# EAGLE schematic ccnor_stm32_v24-sync (EAGLE 6.1)
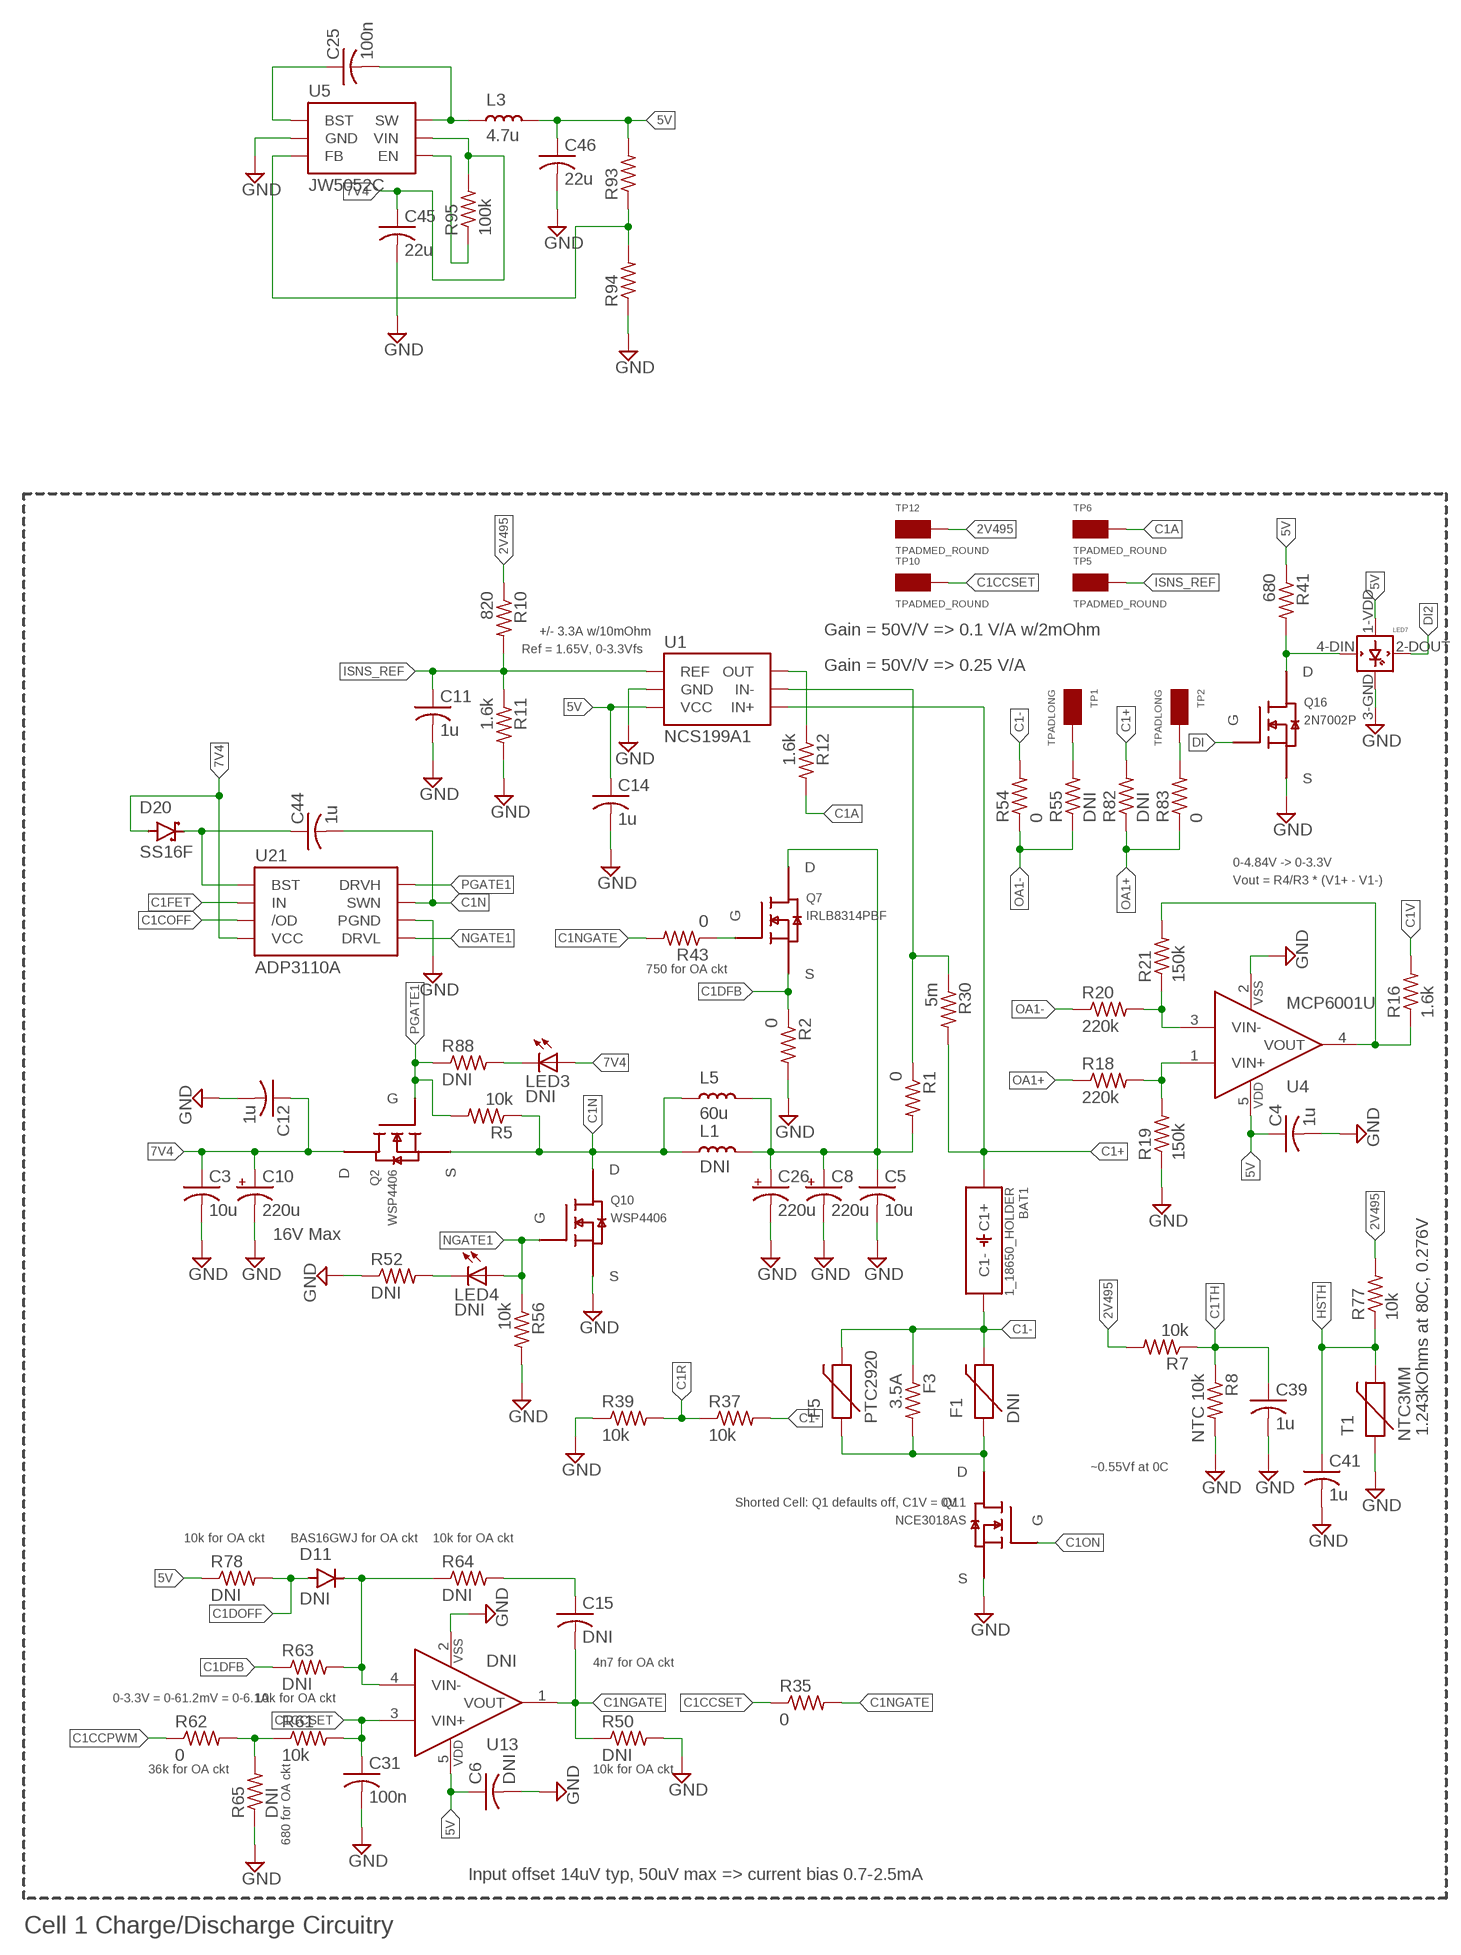
[diagram p0: schematic, sheet 1, part 1 of 2]
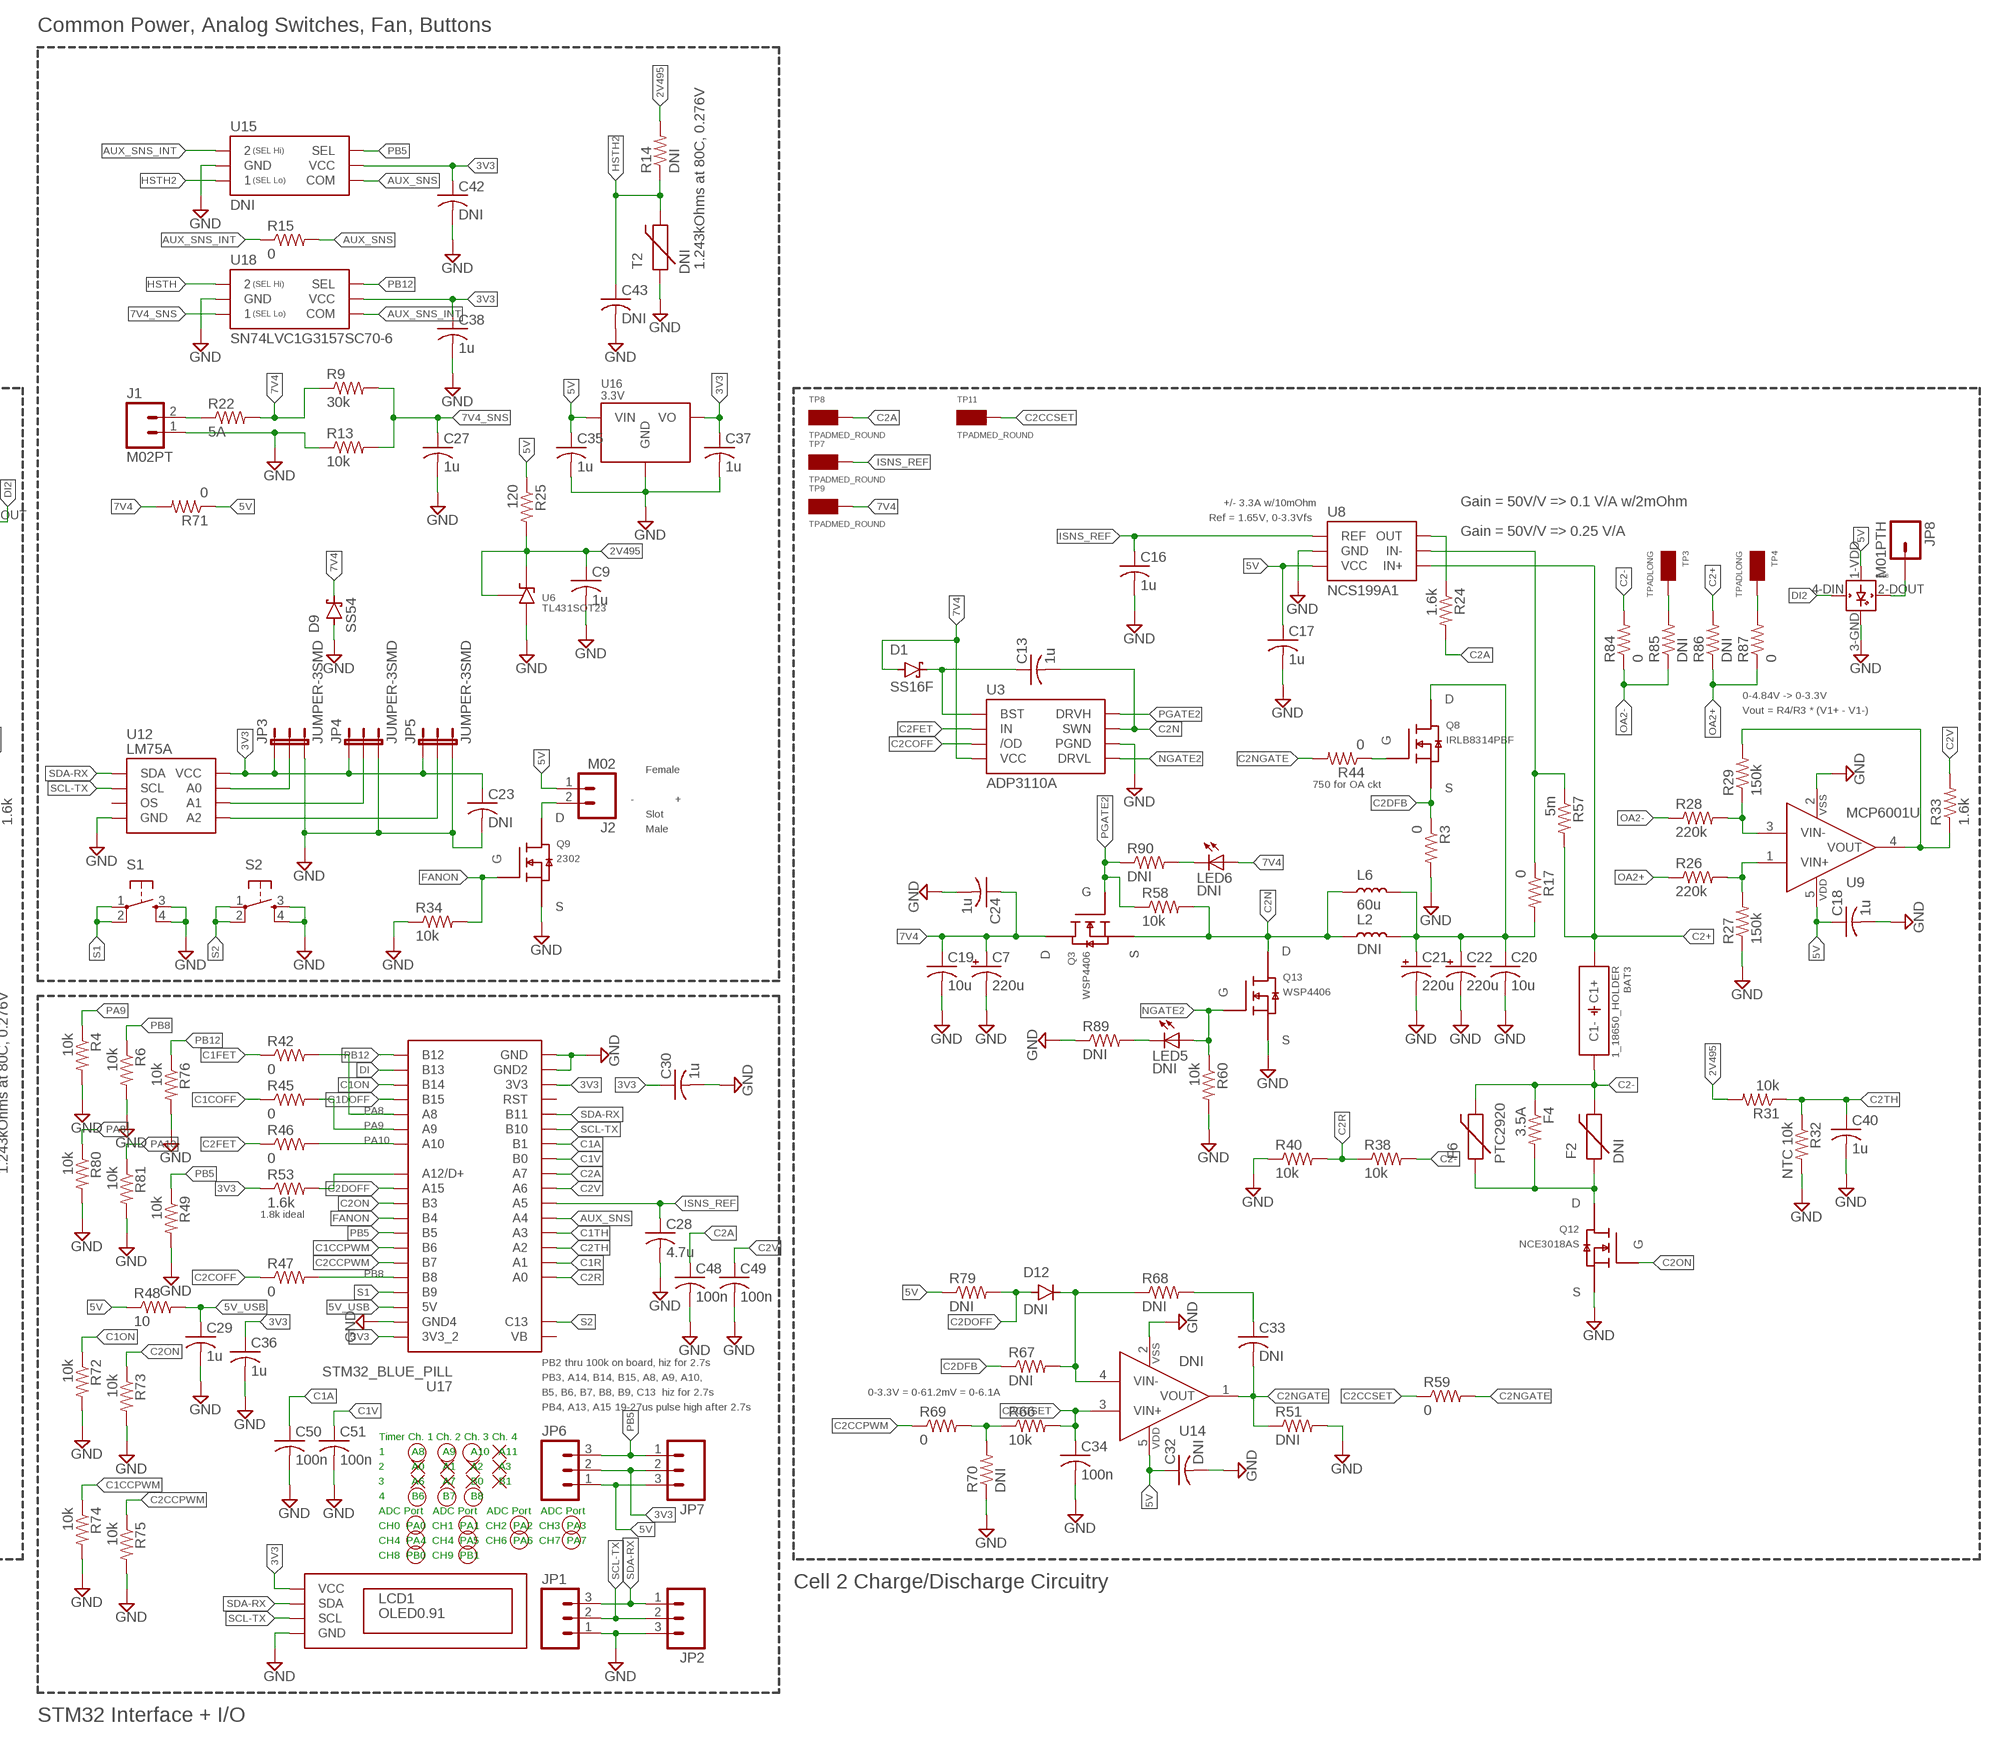
[diagram p1: schematic, sheet 1, part 2 of 2]

## Parts
BAT1  1_18650_HOLDER  [1S_18650_SMD_NH]
BAT3  1_18650_HOLDER  [1S_18650_SMD_NH]
C3  10u  C-USC1206  [C1206]
C4  1u  C-USC0402  [C0402]
C5  10u  C-USC1206  [C1206]
C6  DNI  C-USC0402  [C0402]
C7  220u  CPOL-USD  [PANASONIC_D]
C8  220u  CPOL-USD  [PANASONIC_D]
C9  1u  C-USC0402  [C0402]
C10  220u  CPOL-USD  [PANASONIC_D]
C11  1u  C-USC0402  [C0402]
C12  1u  C-USC0402  [C0402]
C13  1u  C-USC0603  [C0603]
C14  1u  C-USC0402  [C0402]
C15  DNI  C-USC0402  [C0402]
C16  1u  C-USC0402  [C0402]
C17  1u  C-USC0402  [C0402]
C18  1u  C-USC0402  [C0402]
C19  10u  C-USC1206  [C1206]
C20  10u  C-USC1206  [C1206]
C21  220u  CPOL-USD  [PANASONIC_D]
C22  220u  CPOL-USD  [PANASONIC_D]
C23  DNI  C-USC0402  [C0402]
C24  1u  C-USC0402  [C0402]
C25  100n  C-USC0402  [C0402]
C26  220u  CPOL-USD  [PANASONIC_D]
C27  1u  C-USC0402  [C0402]
C28  4.7u  C-USC0402  [C0402]
C29  1u  C-USC0402  [C0402]
C30  1u  C-USC0402  [C0402]
C31  100n  C-USC0402  [C0402]
C32  DNI  C-USC0402  [C0402]
C33  DNI  C-USC0402  [C0402]
C34  100n  C-USC0402  [C0402]
C35  1u  C-USC0402  [C0402]
C36  1u  C-USC0402  [C0402]
C37  1u  C-USC0402  [C0402]
C38  1u  C-USC0402  [C0402]
C39  1u  C-USC0402  [C0402]
C40  1u  C-USC0402  [C0402]
C41  1u  C-USC0402  [C0402]
C42  DNI  C-USC0402  [C0402]
C43  DNI  C-USC0402  [C0402]
C44  1u  C-USC0603  [C0603]
C45  22u  C-USC0805  [C0805]
C46  22u  C-USC0603  [C0603]
C48  100n  C-USC0402  [C0402]
C49  100n  C-USC0402  [C0402]
C50  100n  C-USC0402  [C0402]
C51  100n  C-USC0402  [C0402]
D1  SS16F  DIODE_SCHOTTKYCDBM140-G  [SOD123]
D9  SS54  [SMA]
D11  DNI  BAT60A  [SOD323]
D12  DNI  BAT60A  [SOD323]
D20  SS16F  DIODE_SCHOTTKYCDBM140-G  [SOD123]
F1  DNI  PTC1812  [1812]
F2  DNI  PTC1812  [1812]
F3  3.5A  R-US_R1206  [R1206]
F4  3.5A  R-US_R1206  [R1206]
F5  PTC2920  [2920]
F6  PTC2920  [2920]
J1  M02PT  [PHOENIXCONTACT1935161]
J2  M02  [B2B-XH-A]
JP1  M03PTH  [1X03]
JP2  M03PTH  [1X03]
JP3  JUMPER-3SMD  [SJ_3]
JP4  JUMPER-3SMD  [SJ_3]
JP5  JUMPER-3SMD  [SJ_3]
JP6  M03PTH  [1X03]
JP7  M03PTH  [1X03]
JP8  M01PTH  [1X01]
L1  DNI  SDR1307  [INDUCTOR_SMD_13MM]
L2  DNI  SDR1307  [INDUCTOR_SMD_13MM]
L3  4.7u  INDUCTOR0805  [0805]
L5  60u  INDUCTOR10A  [INDUCTOR_10A_8.2MMX21MM]
L6  60u  INDUCTOR10A  [INDUCTOR_10A_8.2MMX21MM]
LCD1  OLED0.91  [OLED0.91]
LED3  DNI  LEDCHIPLED_0603  [CHIPLED_0603]
LED4  DNI  LEDCHIPLED_0603  [CHIPLED_0603]
LED5  DNI  LEDCHIPLED_0603  [CHIPLED_0603]
LED6  DNI  LEDCHIPLED_0603  [CHIPLED_0603]
LED7  WS2812B  [WS2812B]
LED8  WS2812B  [WS2812B]
Q2  WSP4406  N-MOSFET-SOIC8  [8-SOIC]
Q3  WSP4406  N-MOSFET-SOIC8  [8-SOIC]
Q7  IRLB8314PBF  [TO-220]
Q8  IRLB8314PBF  [TO-220]
Q9  2302  2N7002P  [SOT23]
Q10  WSP4406  N-MOSFET-SOIC8  [8-SOIC]
Q11  NCE3018AS  N-MOSFET-SOIC8  [8-SOIC]
Q12  NCE3018AS  N-MOSFET-SOIC8  [8-SOIC]
Q13  WSP4406  N-MOSFET-SOIC8  [8-SOIC]
Q16  2N7002P  [SOT23]
R1  0  R-US_R1206  [R1206]
R2  0  R-US_R1206  [R1206]
R3  0  R-US_R1206  [R1206]
R4  10k  R-US_R0402  [R0402]
R5  10k  R-US_R0402  [R0402]
R6  10k  R-US_R0402  [R0402]
R7  10k  R-US_R0402  [R0402]
R8  NTC 10k  R-US_R0402  [R0402]
R9  30k  R-US_R0402  [R0402]
R10  820  R-US_R0402  [R0402]
R11  1.6k  R-US_R0402  [R0402]
R12  1.6k  R-US_R0402  [R0402]
R13  10k  R-US_R0402  [R0402]
R14  DNI  R-US_R0402  [R0402]
R15  0  R-US_R0402  [R0402]
R16  1.6k  R-US_R0402  [R0402]
R17  0  R-US_R1206  [R1206]
R18  220k  R-US_R0402  [R0402]
R19  150k  R-US_R0402  [R0402]
R20  220k  R-US_R0402  [R0402]
R21  150k  R-US_R0402  [R0402]
R22  5A  R-US_R1206  [R1206]
R24  1.6k  R-US_R0402  [R0402]
R25  120  R-US_R0402  [R0402]
R26  220k  R-US_R0402  [R0402]
R27  150k  R-US_R0402  [R0402]
R28  220k  R-US_R0402  [R0402]
R29  150k  R-US_R0402  [R0402]
R30  5m  R-US_R1206  [R1206]
R31  10k  R-US_R0402  [R0402]
R32  NTC 10k  R-US_R0402  [R0402]
R33  1.6k  R-US_R0402  [R0402]
R34  10k  R-US_R0402  [R0402]
R35  0  R-US_R0402  [R0402]
R37  10k  R-US_R0402  [R0402]
R38  10k  R-US_R0402  [R0402]
R39  10k  R-US_R0402  [R0402]
R40  10k  R-US_R0402  [R0402]
R41  680  R-US_R0402  [R0402]
R42  0  R-US_R0402  [R0402]
R43  0  R-US_R0402  [R0402]
R44  0  R-US_R0402  [R0402]
R45  0  R-US_R0402  [R0402]
R46  0  R-US_R0402  [R0402]
R47  0  R-US_R0402  [R0402]
R48  10  R-US_R0402  [R0402]
R49  10k  R-US_R0402  [R0402]
R50  DNI  R-US_R0402  [R0402]
R51  DNI  R-US_R0402  [R0402]
R52  DNI  R-US_R0402  [R0402]
R53  1.6k  R-US_R0402  [R0402]
R54  0  R-US_R0402  [R0402]
R55  DNI  R-US_R0402  [R0402]
R56  10k  R-US_R0402  [R0402]
R57  5m  R-US_R1206  [R1206]
R58  10k  R-US_R0402  [R0402]
R59  0  R-US_R0402  [R0402]
R60  10k  R-US_R0402  [R0402]
R61  10k  R-US_R0402  [R0402]
R62  0  R-US_R0402  [R0402]
R63  DNI  R-US_R0402  [R0402]
R64  DNI  R-US_R0402  [R0402]
R65  DNI  R-US_R0402  [R0402]
R66  10k  R-US_R0402  [R0402]
R67  DNI  R-US_R0402  [R0402]
R68  DNI  R-US_R0402  [R0402]
R69  0  R-US_R0402  [R0402]
R70  DNI  R-US_R0402  [R0402]
R71  0  R-US_R0603  [R0603]
R72  10k  R-US_R0402  [R0402]
R73  10k  R-US_R0402  [R0402]
R74  10k  R-US_R0402  [R0402]
R75  10k  R-US_R0402  [R0402]
R76  10k  R-US_R0402  [R0402]
R77  10k  R-US_R0402  [R0402]
R78  DNI  R-US_R0402  [R0402]
R79  DNI  R-US_R0402  [R0402]
R80  10k  R-US_R0402  [R0402]
R81  10k  R-US_R0402  [R0402]
R82  DNI  R-US_R0402  [R0402]
R83  0  R-US_R0402  [R0402]
R84  0  R-US_R0402  [R0402]
R85  DNI  R-US_R0402  [R0402]
R86  DNI  R-US_R0402  [R0402]
R87  0  R-US_R0402  [R0402]
R88  DNI  R-US_R0402  [R0402]
R89  DNI  R-US_R0402  [R0402]
R90  DNI  R-US_R0402  [R0402]
R93  R-US_R0402  [R0402]
R94  R-US_R0402  [R0402]
R95  100k  R-US_R0402  [R0402]
S1  TAC_SWITCHSMD  [TACTILE_SWITCH_SMD]
S2  TAC_SWITCHSMD  [TACTILE_SWITCH_SMD]
T1  NTC3MM  PTCNTC3MM  [THERMISTOR_3MMX3MM]
T2  DNI  PTCNTC3MM  [THERMISTOR_3MMX3MM]
TP1  TPADLONG  [TPAD_LONG]
TP2  TPADLONG  [TPAD_LONG]
TP3  TPADLONG  [TPAD_LONG]
TP4  TPADLONG  [TPAD_LONG]
TP5  TPADMED_ROUND  [TPAD_MED_ROUND]
TP6  TPADMED_ROUND  [TPAD_MED_ROUND]
TP7  TPADMED_ROUND  [TPAD_MED_ROUND]
TP8  TPADMED_ROUND  [TPAD_MED_ROUND]
TP9  TPADMED_ROUND  [TPAD_MED_ROUND]
TP10  TPADMED_ROUND  [TPAD_MED_ROUND]
TP11  TPADMED_ROUND  [TPAD_MED_ROUND]
TP12  TPADMED_ROUND  [TPAD_MED_ROUND]
U1  NCS199A1  INA214  [SOT-363]
U3  ADP3110A  [8-SOIC]
U4  MCP6001U  [SOT23-5]
U5  JW5052C  [SOT23-6]
U6  TL431SOT23  [SOT23]
U8  NCS199A1  INA214  [SOT-363]
U9  MCP6001U  [SOT23-5]
U12  LM75A  [8-SOIC]
U13  DNI  NCS325  [SOT23-5]
U14  DNI  NCS325  [SOT23-5]
U15  DNI  SN74LVC1G3157SC70-6  [SC70-6]
U16  3.3V  AP1117UR133-B  [SOT-89]
U17  STM32_BLUE_PILL  [STM32_BLUE_PILL_USABLE]
U18  SN74LVC1G3157SC70-6  [SC70-6]
U21  ADP3110A  [8-SOIC]

## Nets
2V495: C9.1 R7.2 R10.1 R14.2 R25.2 R31.2 R77.2 TP12.1 U6.1(K) U6.2(REF)
3V3: C23.1 C30.1 C36.1 C37.1 C38.1 C42.1 JP3.1 JP4.1 JP5.1 JP6.2 JP7.2 LCD1.2-VCC(VCC) R53.1 U12.8(VCC) U15.5(VCC) U16.1(VO) U17.3V3 U17.3V3_2 U18.5(VCC)
5V: C4.1 C6.1 C14.1 C17.1 C18.1 C32.1 C35.1 C46.1 J2.1 JP6.1 JP7.3 L3.2 LED7.1-VDD(VDD) LED8.1-VDD(VDD) R25.1 R41.1 R48.1 R71.1 R78.1 R79.1 R93.2 U1.3(VCC) U4.5(VDD) U8.3(VCC) U9.5(VDD) U13.5(VDD) U14.5(VDD) U16.3(VIN)
5V_USB: C29.1 R48.2 U17.5V
7V4: C3.1 C7.+ C10.+ C12.1 C19.1 C24.1 C45.1 D1.A(ANODE) D9.K(CATHODE) D20.A(ANODE) LED3.A LED6.A Q2.5(D) Q2.6(D) Q2.7(D) Q2.8(D) Q3.5(D) Q3.6(D) Q3.7(D) Q3.8(D) R9.1 R22.2 R71.2 R95.2 TP9.1 U3.4(VCC) U5.5(VIN) U21.4(VCC)
7V4_SNS: C27.1 R9.2 R13.2 U18.3
AUX_SNS: R15.2 U15.4(COM) U17.A4
AUX_SNS_INT: R15.1 U15.1 U18.4(COM)
BST: C44.1 D20.K(CATHODE) U21.1(BST)
BST2: C13.1 D1.K(CATHODE) U3.1(BST)
C1+: BAT1.1+(C1+) R30.2 R82.2 U1.4(IN+)
C1-: BAT1.1-(C1-) F1.2 F3.1 F5.K R37.2 R54.2
C1A: C50.1 R12.2 TP6.1 U17.B1
C1CCPWM: R62.1 R74.1 U17.B6
C1CCSET: C31.1 R35.1 R61.2 TP10.1 U13.3(VIN+)
C1COFF: R45.1 U21.3(/OD)
C1DFB: Q7.3(S) R2.1 R63.1
C1DOFF: D11.A(ANODE) R78.2 U17.B15
C1FET: R42.1 U21.2(IN)
C1N: C44.2 L1.1 L5.P$1 Q2.1(S) Q2.2(S) Q2.3(S) Q10.5(D) Q10.6(D) Q10.7(D) Q10.8(D) R5.1 U21.7(SWN)
C1NGATE: C15.2 R35.2 R43.2 R50.1 U13.1(VOUT)
C1ON: Q11.4(G) R72.1 U17.B14
C1R: R37.1 R39.2 U17.A1
C1TH: C39.1 R7.1 R8.1 U17.A3
C1V: C51.1 R16.2 U17.B0
C1V_OA: R16.1 R21.2 U4.4(VOUT)
C1VFBN: C15.1 R64.2
C1VFBN2: C33.1 R68.2
C2+: BAT3.1+(C1+) R57.2 R86.2 U8.4(IN+)
C2-: BAT3.1-(C1-) F2.2 F4.1 F6.K R38.2 R84.2
C2A: C48.1 R24.2 TP8.1 U17.A7
C2CCPWM: R69.1 R75.1 U17.B7
C2CCSET: C34.1 R59.1 R66.2 TP11.1 U14.3(VIN+)
C2COFF: R47.1 U3.3(/OD)
C2DFB: Q8.3(S) R3.1 R67.1
C2DOFF: D12.A(ANODE) R79.2 U17.A15
C2FET: R46.1 U3.2(IN)
C2N: C13.2 L2.1 L6.P$1 Q3.1(S) Q3.2(S) Q3.3(S) Q13.5(D) Q13.6(D) Q13.7(D) Q13.8(D) R58.2 U3.7(SWN)
C2NGATE: C33.2 R44.2 R51.1 R59.2 U14.1(VOUT)
C2ON: Q12.4(G) R73.1 U17.B3
C2R: R38.1 R40.2 U17.A0
C2TH: C40.1 R31.1 R32.1 U17.A2
C2V: C49.1 R33.2 U17.A6
C2V_OA: R29.2 R33.1 U9.4(VOUT)
DI: Q16.1(G) U17.B13
DI1: LED7.4-DIN(DIN) Q16.3(D) R41.2
DI2: LED7.2-DOUT(DOUT) LED8.4-DIN(DIN)
FANON: Q9.1(G) R34.2 U17.B4
GND: C3.2 C4.2 C5.2 C6.2 C7.- C8.- C9.2 C10.- C11.2 C12.2 C14.2 C16.2 C17.2 C18.2 C19.2 C20.2 C21.- C22.- C23.2 C24.2 C26.- C27.2 C28.2 C29.2 C30.2 C31.2 C32.2 C34.2 C35.2 C36.2 C37.2 C38.2 C39.2 C40.2 C41.2 C42.2 C43.2 C45.2 C46.2 C48.2 C49.2 C50.2 C51.2 D9.A(ANODE) J1.1 JP1.1 JP2.3 JP3.3 JP4.3 JP5.3 LCD1.1=GND(GND) LED7.3-GND(GND) LED8.3-GND(GND) Q9.2(S) Q10.1(S) Q10.2(S) Q10.3(S) Q11.1(S) Q11.2(S) Q11.3(S) Q12.1(S) Q12.2(S) Q12.3(S) Q13.1(S) Q13.2(S) Q13.3(S) Q16.2(S) R2.2 R3.2 R4.2 R6.2 R8.2 R11.2 R13.1 R19.1 R27.1 R32.2 R34.1 R39.1 R40.1 R49.2 R50.2 R51.2 R52.1 R56.2 R60.2 R65.1 R70.1 R72.2 R73.2 R74.2 R75.2 R76.2 R80.2 R81.2 R89.1 R94.1 S1.3 S1.4 S2.3 S2.4 T1.1 T2.1 U1.2(GND) U3.6(PGND) U4.2(VSS) U5.2(GND) U6.3(A) U8.2(GND) U9.2(VSS) U12.4(GND) U13.2(VSS) U14.2(VSS) U15.2(GND) U16.2(GND) U16.2@1(GND) U17.GND U17.GND2 U17.GND4 U18.2(GND) U21.6(PGND)
HSTH: C41.1 R77.1 T1.2 U18.1
HSTH2: C43.1 R14.1 T2.2 U15.3
I1SET: R61.1 R62.2 R65.2
I1SET2: R66.1 R69.2 R70.2
IN-1: R1.1 R30.1 U1.5(IN-)
IN-2: R17.1 R57.1 U8.5(IN-)
IS1O: R12.1 U1.6(OUT)
IS1O1: R24.1 U8.6(OUT)
ISNS_REF: C11.1 C16.1 C28.1 R10.2 R11.1 TP5.1 TP7.1 U1.1(REF) U8.1(REF) U17.A5
N$1: LED3.C R88.2
N$2: F2.1 F4.2 F6.A Q12.5(D) Q12.6(D) Q12.7(D) Q12.8(D)
N$3: R18.2 R19.2 U4.1(VIN+)
N$4: R20.2 R21.1 U4.3(VIN-)
N$5: R85.2 TP3.P$1
N$6: JP8.1 LED8.2-DOUT(DOUT)
N$7: D12.K(CATHODE) R67.2 R68.1 U14.4(VIN-)
N$8: C25.1 U5.1(BST)
N$9: LED6.C R90.2
N$11: C25.2 L3.1 U5.6(SW)
N$13: J1.2 R22.1
N$16: R26.2 R27.2 U9.1(VIN+)
N$17: R28.2 R29.1 U9.3(VIN-)
N$18: R93.1 R94.2 U5.3(FB)
N$19: R55.2 TP1.P$1
N$20: LED4.C R52.2
N$23: R95.1 U5.4(EN)
N$24: D11.K(CATHODE) R63.2 R64.1 U13.4(VIN-)
N$25: LED5.C R89.2
N$26: R53.2 U17.A12(A12/D+)
N$27: JP3.2 U12.7(A0)
N$28: JP4.2 U12.6(A1)
N$29: JP5.2 U12.5(A2)
N$30: R83.2 TP2.P$1
N$31: R87.2 TP4.P$1
N$32: F1.1 F3.2 F5.A Q11.5(D) Q11.6(D) Q11.7(D) Q11.8(D)
N$34: J2.2 Q9.3(D)
NGATE1: LED4.A Q10.4(G) R56.1 U21.5(DRVL)
NGATE2: LED5.A Q13.4(G) R60.1 U3.5(DRVL)
OA1+: R18.1 R82.1 R83.1
OA1-: R20.1 R54.1 R55.1
OA2+: R26.1 R86.1 R87.1
OA2-: R28.1 R84.1 R85.1
PA8: R42.2 R80.1 U17.A8
PA9: R4.1 R45.2 U17.A9
PA10: R46.2 R81.1 U17.A10
PB5: JP6.3 JP7.1 R49.1 U15.6(SEL) U17.B5
PB8: R6.1 R47.2 U17.B8
PB12: R76.1 U17.B12 U18.6(SEL)
PGATE1: Q2.4(G) R5.2 R88.1 U21.8(DRVH)
PGATE2: Q3.4(G) R58.1 R90.1 U3.8(DRVH)
PWR1: C5.1 C8.+ C26.+ L1.2 L5.P$2 Q7.2(D) R1.2
PWR2: C20.1 C21.+ C22.+ L2.2 L6.P$2 Q8.2(D) R17.2
Q7G: Q7.1(G) R43.1
Q8G: Q8.1(G) R44.1
S1: S1.1 S1.2 U17.B9
S2: S2.1 S2.2 U17.C13
SCL-TX: JP1.2 JP2.2 LCD1.3=SCL(SCL) U12.2(SCL) U17.B10
SDA-RX: JP1.3 JP2.1 LCD1.4-SDA(SDA) U12.1(SDA) U17.B11
Unconnected: U12.3(OS) U17.RST U17.VBAT(VB)

## Notes on the sheet
- Common Power, Analog Switches, Fan, Buttons
- 1.243kOhms at 80C, 0.276V
- +/- 3.3A w/10mOhm | Gain = 50V/V => 0.1 V/A w/2mOhm | +/- 3.3A w/10mOhm | Gain = 50V/V => 0.1 V/A w/2mOhm
- Ref = 1.65V, 0-3.3Vfs | Ref = 1.65V, 0-3.3Vfs
- Gain = 50V/V => 0.25 V/A | Gain = 50V/V => 0.25 V/A
- 0-4.84V -> 0-3.3V | 0-4.84V -> 0-3.3V
- Vout = R4/R3 * (V1+ - V1-) | Vout = R4/R3 * (V1+ - V1-)
- Female
- 750 for OA ckt | 750 for OA ckt
- - | +
- Slot
- Male
- 16V Max
- 1.243kOhms at 80C, 0.276V
- ~0.55Vf at 0C
- 1.8k ideal
- Shorted Cell: Q1 defaults off, C1V = 0V
- 10k for OA ckt | BAS16GWJ for OA ckt | 10k for OA ckt
- 4n7 for OA ckt | PB2 thru 100k on board, hiz for 2.7s
- PB3, A14, B14, B15, A8, A9, A10,
- 0-3.3V = 0-61.2mV = 0-6.1A | 10k for OA ckt | B5, B6, B7, B8, B9, C13  hiz for 2.7s | 0-3.3V = 0-61.2mV = 0-6.1A
- PB4, A13, A15 19-27us pulse high after 2.7s
- Timer Ch. 1 Ch. 2 Ch. 3 Ch. 4
- 36k for OA ckt | 10k for OA ckt | 1         A8      A9     A10   A11
- 2         A0      A1     A2     A3
- 3         A6      A7     B0     B1
- 4         B6      B7     B8
- 680 for OA ckt | ADC Port   ADC Port   ADC Port   ADC Port
- CH0  PA0  CH1  PA1  CH2  PA2  CH3  PA3
- Input offset 14uV typ, 50uV max => current bias 0.7-2.5mA | CH4  PA4  CH4  PA5  CH6  PA6  CH7  PA7
- CH8  PB0  CH9  PB1
- Cell 1 Charge/Discharge Circuitry | Cell 2 Charge/Discharge Circuitry
- STM32 Interface + I/O

## Library data of the parts
BAT1 BAT3 = custom:1_18650_HOLDER
C3-C6 C9 C11-C20 C23-C25 C27-C46 C48-C51 = resistor:C-US: CAPACITOR, American symbol
C7 C8 C10 C21 C22 C26 = resistor:CPOL-US: POLARIZED CAPACITOR, American symbol
D1 D20 = custom:DIODE_SCHOTTKY: 40V 1A 500mV @1A
D9 = custom:SS54: Diode Schottky 40V 5A 1mA Ir 0.55Vf
D11 D12 = custom:BAT60A: Schottky Diode 10V 3A 0.37V at 1A
F1 F2 F5 F6 T1 T2 = custom:PTC
F3 F4 R1-R22 R24-R35 R37-R90 R93-R95 = resistor:R-US_: RESISTOR, American symbol
J1 J2 = custom:M02
JP1 JP2 JP6 JP7 = SparkFun:M03: Header 3 Standard 3-pin 0.1" header. Use with straight break away headers (SKU : PRT-00116), right angle break away headers (PRT-00553), swiss pins (PRT-00743), machine pins (PRT-00117), and female headers (PRT-00115). Molex polarized connector foot print use with SKU : PRT-08232 with associated crimp pins and housings.
JP3-JP5 = SparkFun:JUMPER-3
JP8 = SparkFun:M01: Header 1 Standard 1-pin 0.1" header. Use with straight break away headers (SKU : PRT-00116), right angle break away headers (PRT-00553), swiss pins (PRT-00743), machine pins (PRT-00117), and female headers (PRT-00115).
L1 L2 = custom:SDR1307
L3 L5 L6 = custom:INDUCTOR
LCD1 = custom:OLED0.91
LED3-LED6 = led:LED: LED OSRAM: - CHIPLED LG R971, LG N971, LY N971, LG Q971, LY Q971, LO R971, LY R971 LH N974, LH R974 LS Q976, LO Q976, LY Q976 LO Q996 - Hyper CHIPLED LW Q18S LB Q993, LB Q99A, LB R99A - SideLED LS A670, LO A670, LY A670, LG A670, LP A670 LB A673, LV A673, LT A673, LW A673 LH A674 LY A675 LS A676, LA A676, LO A676, LY A676, LW A676 LS A679, LY A679, LG A679 - Hyper Micro SIDELED® LS Y876, LA Y876, LO Y876, LY Y876 LT Y87S - SmartLED LW L88C, LW L88S LB L89C, LB L89S, LG L890 LS L89K, LO L89K, LY L89K LS L896, LA L896, LO L896, LY L896 - TOPLED LS T670, LO T670, LY T670, LG T670, LP T670 LSG T670, LSP T670, LSY T670, LOP T670, LYG T670 LG T671, LOG T671, LSG T671 LB T673, LV T673, LT T673, LW T673 LH T674 LS T676, LA T676, LO T676, LY T676, LB T676, LH T676, LSB T676, LW T676 LB T67C, LV T67C, LT T67C, LS T67K, LO T67K, LY T67K, LW E67C LS E67B, LA E67B, LO E67B, LY E67B, LB E67C, LV E67C, LT E67C LW T67C LS T679, LY T679, LG T679 LS T770, LO T770, LY T770, LG T770, LP T770 LB T773, LV T773, LT T773, LW T773 LH T774 LS E675, LA E675, LY E675, LS T675 LS T776, LA T776, LO T776, LY T776, LB T776 LHGB T686 LT T68C, LB T68C - Hyper Mini TOPLED® LB M676 - Mini TOPLED Santana® LG M470 LS M47K, LO M47K, LY M47K Source: http://www.osram.convergy.de LUXEON: - LUMILED® LXK2-PW12-R00, LXK2-PW12-S00, LXK2-PW14-U00, LXK2-PW14-V00 LXK2-PM12-R00, LXK2-PM12-S00, LXK2-PM14-U00 LXK2-PE12-Q00, LXK2-PE12-R00, LXK2-PE12-S00, LXK2-PE14-T00, LXK2-PE14-U00 LXK2-PB12-K00, LXK2-PB12-L00, LXK2-PB12-M00, LXK2-PB14-N00, LXK2-PB14-P00, LXK2-PB14-Q00 LXK2-PR12-L00, LXK2-PR12-M00, LXK2-PR14-Q00, LXK2-PR14-R00 LXK2-PD12-Q00, LXK2-PD12-R00, LXK2-PD12-S00 LXK2-PH12-R00, LXK2-PH12-S00 LXK2-PL12-P00, LXK2-PL12-Q00, LXK2-PL12-R00 Source: www.luxeon.com KINGBRIGHT: KA-3528ASYC Source: www.kingbright.com
LED7 LED8 = adafruit:WS2812B
Q2 Q3 Q10-Q13 = custom:N-MOSFET-SOIC8
Q7 Q8 = custom:IRLB8314PBF: MOSFET N-Channel 30V 184A 3.2mOhm @4.5Vgs 125W
Q9 Q16 = custom:2N7002P: 2N7002P N-channel MOSFET 60V 360mA Logic Level
S1 S2 = SparkFun:TAC_SWITCH: Momentary Switch Button commonly used for reset or general input. Spark Fun Electronics SKU : COM-00097
TP1-TP12 = custom:TPAD
U1 U8 = custom:INA214: Current Shunt Amplifier 30kHz 2.7-26V
U3 U21 = custom:ADP3110A: MOSFET Driver Dual Bootstrapped 12 V w/Output Disable 3nF 25ns Synchronous
U4 U9 = custom:MCP6001: Op-Amp Single Rail-to-Rail 1MHz
U5 = custom:JW5052C: Buck Regulator Synchronous 4.5-18V 2A 700kHz 100uA 120mOhm
U6 = custom:TL431: Shunt Voltage Reference IC 700uA 100mA 36V
U12 = custom:LM75A: I2C Temperature Sensor -55 to 125 C 11b 8-SOIC
U13 U14 = custom:NCS325
U15 U18 = custom:SN74LVC1G3157: Single Analog Mux IC Switch 2:1 15 Ohm 1.65-5.5V
U16 = custom:AP1117: Linear Voltage Regulator 18V Max 1A
U17 = custom:STM32_BLUE_PILL